# Altium schematic sheet Output_Expander.SchDoc
size A3; SheetNumber: 28; SheetTotal: 29
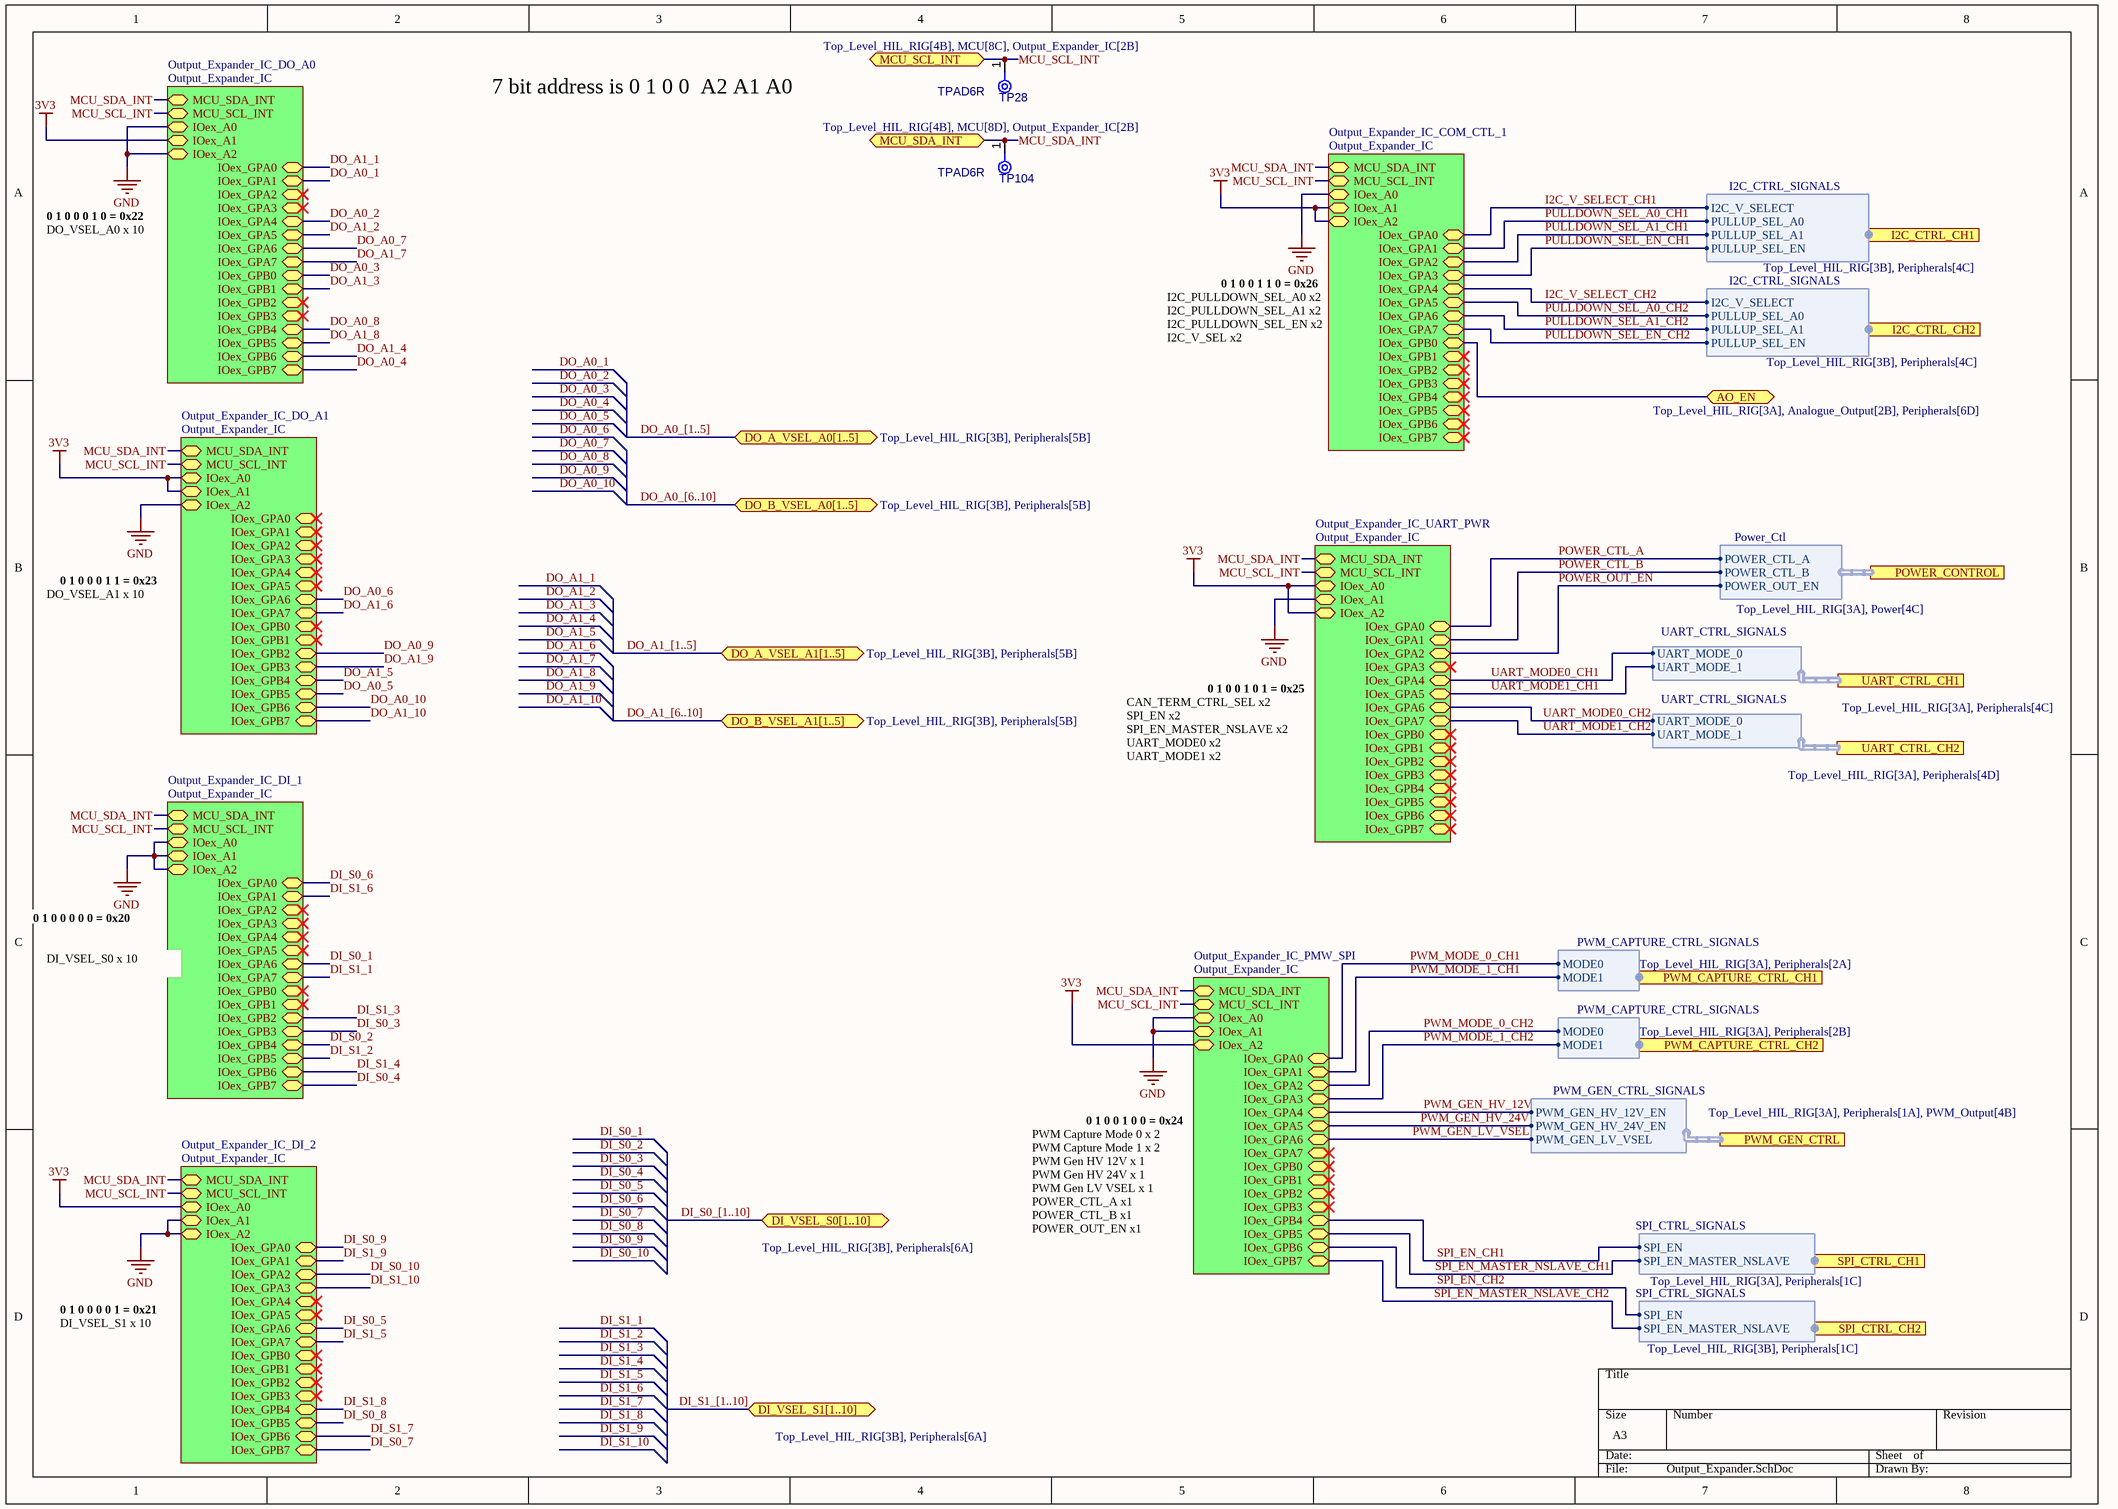
[diagram p0: Output_Expander.SchDoc]

## Parts
TP28  TPAD6R  [TP06R]  (no BOM)
TP104  TPAD6R  [TP06R]  (no BOM)

## Sub-sheets
Output_Expander_IC_COM_CTL_1 = Output_Expander_IC: MCU_SDA_INT (bidir), MCU_SCL_INT (bidir), IOex_A0 (bidir), IOex_A1 (bidir), IOex_A2 (bidir), IOex_GPA0 (bidir), IOex_GPA1 (bidir), IOex_GPA2 (bidir), IOex_GPA3 (bidir), IOex_GPA4 (bidir), IOex_GPA5 (bidir), IOex_GPA6 (bidir), IOex_GPA7 (bidir), IOex_GPB0 (bidir), IOex_GPB1 (bidir), IOex_GPB3 (bidir), IOex_GPB4 (bidir), IOex_GPB5 (bidir), IOex_GPB6 (bidir), IOex_GPB2 (bidir), IOex_GPB7 (bidir)
Output_Expander_IC_DI_1 = Output_Expander_IC: MCU_SDA_INT (bidir), MCU_SCL_INT (bidir), IOex_A0 (bidir), IOex_A1 (bidir), IOex_A2 (bidir), IOex_GPA0 (bidir), IOex_GPA1 (bidir), IOex_GPA2 (bidir), IOex_GPA3 (bidir), IOex_GPA4 (bidir), IOex_GPA5 (bidir), IOex_GPA6 (bidir), IOex_GPA7 (bidir), IOex_GPB0 (bidir), IOex_GPB1 (bidir), IOex_GPB3 (bidir), IOex_GPB4 (bidir), IOex_GPB5 (bidir), IOex_GPB6 (bidir), IOex_GPB2 (bidir), IOex_GPB7 (bidir)
Output_Expander_IC_DI_2 = Output_Expander_IC: MCU_SDA_INT (bidir), MCU_SCL_INT (bidir), IOex_A0 (bidir), IOex_A1 (bidir), IOex_A2 (bidir), IOex_GPA0 (bidir), IOex_GPA1 (bidir), IOex_GPA2 (bidir), IOex_GPA3 (bidir), IOex_GPA4 (bidir), IOex_GPA5 (bidir), IOex_GPA6 (bidir), IOex_GPA7 (bidir), IOex_GPB0 (bidir), IOex_GPB1 (bidir), IOex_GPB3 (bidir), IOex_GPB4 (bidir), IOex_GPB5 (bidir), IOex_GPB6 (bidir), IOex_GPB2 (bidir), IOex_GPB7 (bidir)
Output_Expander_IC_DO_A0 = Output_Expander_IC: MCU_SDA_INT (bidir), MCU_SCL_INT (bidir), IOex_A0 (bidir), IOex_A1 (bidir), IOex_A2 (bidir), IOex_GPA0 (bidir), IOex_GPA1 (bidir), IOex_GPA2 (bidir), IOex_GPA3 (bidir), IOex_GPA4 (bidir), IOex_GPA5 (bidir), IOex_GPA6 (bidir), IOex_GPA7 (bidir), IOex_GPB0 (bidir), IOex_GPB1 (bidir), IOex_GPB3 (bidir), IOex_GPB4 (bidir), IOex_GPB5 (bidir), IOex_GPB6 (bidir), IOex_GPB2 (bidir), IOex_GPB7 (bidir)
Output_Expander_IC_DO_A1 = Output_Expander_IC: MCU_SDA_INT (bidir), MCU_SCL_INT (bidir), IOex_A0 (bidir), IOex_A1 (bidir), IOex_A2 (bidir), IOex_GPA0 (bidir), IOex_GPA1 (bidir), IOex_GPA2 (bidir), IOex_GPA3 (bidir), IOex_GPA4 (bidir), IOex_GPA5 (bidir), IOex_GPA6 (bidir), IOex_GPB0 (bidir), IOex_GPB1 (bidir), IOex_GPB3 (bidir), IOex_GPB4 (bidir), IOex_GPB5 (bidir), IOex_GPB6 (bidir), IOex_GPB2 (bidir), IOex_GPB7 (bidir), IOex_GPA7 (bidir)
Output_Expander_IC_PMW_SPI = Output_Expander_IC: MCU_SDA_INT (bidir), MCU_SCL_INT (bidir), IOex_A0 (bidir), IOex_A1 (bidir), IOex_A2 (bidir), IOex_GPA0 (bidir), IOex_GPA1 (bidir), IOex_GPA2 (bidir), IOex_GPA3 (bidir), IOex_GPA4 (bidir), IOex_GPA5 (bidir), IOex_GPA6 (bidir), IOex_GPA7 (bidir), IOex_GPB0 (bidir), IOex_GPB1 (bidir), IOex_GPB3 (bidir), IOex_GPB4 (bidir), IOex_GPB5 (bidir), IOex_GPB6 (bidir), IOex_GPB2 (bidir), IOex_GPB7 (bidir)
Output_Expander_IC_UART_PWR = Output_Expander_IC: MCU_SDA_INT (bidir), MCU_SCL_INT (bidir), IOex_A0 (bidir), IOex_A1 (bidir), IOex_A2 (bidir), IOex_GPA0 (bidir), IOex_GPA1 (bidir), IOex_GPA2 (bidir), IOex_GPA3 (bidir), IOex_GPA4 (bidir), IOex_GPA5 (bidir), IOex_GPA6 (bidir), IOex_GPA7 (bidir), IOex_GPB0 (bidir), IOex_GPB1 (bidir), IOex_GPB3 (bidir), IOex_GPB4 (bidir), IOex_GPB5 (bidir), IOex_GPB6 (bidir), IOex_GPB2 (bidir), IOex_GPB7 (bidir)

## Ports
AO_EN (bidir, see Top_Level_HIL_RIG[3A], Analogue_Output[2B], Peripherals[6D]), DI_VSEL_S0[1..10] (bidir, see Top_Level_HIL_RIG[3B], Peripherals[6A]), DI_VSEL_S1[1..10] (bidir, see Top_Level_HIL_RIG[3B], Peripherals[6A]), DO_A_VSEL_A0[1..5] (bidir, see Top_Level_HIL_RIG[3B], Peripherals[5B]), DO_A_VSEL_A1[1..5] (bidir, see Top_Level_HIL_RIG[3B], Peripherals[5B]), DO_B_VSEL_A0[1..5] (bidir, see Top_Level_HIL_RIG[3B], Peripherals[5B]), DO_B_VSEL_A1[1..5] (bidir, see Top_Level_HIL_RIG[3B], Peripherals[5B]), I2C_CTRL_CH1 (harness I2C_CTRL_SIGNALS, see Top_Level_HIL_RIG[3B], Peripherals[4C]), I2C_CTRL_CH2 (harness I2C_CTRL_SIGNALS, see Top_Level_HIL_RIG[3B], Peripherals[4C]), MCU_SCL_INT (bidir, see Top_Level_HIL_RIG[4B], MCU[8C], Output_Expander_IC[2B]), MCU_SDA_INT (bidir, see Top_Level_HIL_RIG[4B], MCU[8D], Output_Expander_IC[2B]), POWER_CONTROL (harness Power_Ctl, see Top_Level_HIL_RIG[3A], Power[4C]), PWM_CAPTURE_CTRL_CH1 (in, harness PWM_CAPTURE_CTRL_SIGNALS, see Top_Level_HIL_RIG[3A], Peripherals[2A]), PWM_CAPTURE_CTRL_CH2 (in, harness PWM_CAPTURE_CTRL_SIGNALS, see Top_Level_HIL_RIG[3A], Peripherals[2B]), PWM_GEN_CTRL (harness PWM_GEN_CTRL_SIGNALS, see Top_Level_HIL_RIG[3A], Peripherals[1A], PWM_Output[4B]), SPI_CTRL_CH1 (harness SPI_CTRL_SIGNALS, see Top_Level_HIL_RIG[3A], Peripherals[1C]), SPI_CTRL_CH2 (harness SPI_CTRL_SIGNALS, see Top_Level_HIL_RIG[3B], Peripherals[1C]), UART_CTRL_CH1 (harness UART_CTRL_SIGNALS, see Top_Level_HIL_RIG[3A], Peripherals[4C]), UART_CTRL_CH2 (harness UART_CTRL_SIGNALS, see Top_Level_HIL_RIG[3A], Peripherals[4D])

## Harnesses
I2C_CTRL_SIGNALS: PULLUP_SEL_A0, PULLUP_SEL_EN, PULLUP_SEL_A1, I2C_V_SELECT
SPI_CTRL_SIGNALS: SPI_EN, SPI_EN_MASTER_NSLAVE
UART_CTRL_SIGNALS: UART_MODE_0, UART_MODE_1
PWM_CAPTURE_CTRL_SIGNALS: MODE1, MODE0
PWM_GEN_CTRL_SIGNALS: PWM_GEN_HV_12V_EN, PWM_GEN_HV_24V_EN, PWM_GEN_LV_VSEL
Power_Ctl: POWER_OUT_EN, POWER_CTL_B, POWER_CTL_A

## Nets
3V3: sheet Output_Expander_IC_DI_2/IOex_A0, sheet Output_Expander_IC_DO_A0/IOex_A1, sheet Output_Expander_IC_DO_A1/IOex_A0, sheet Output_Expander_IC_DO_A1/IOex_A1, sheet Output_Expander_IC_COM_CTL_1/IOex_A1, sheet Output_Expander_IC_COM_CTL_1/IOex_A2, sheet Output_Expander_IC_UART_PWR/IOex_A0, sheet Output_Expander_IC_UART_PWR/IOex_A2, sheet Output_Expander_IC_PMW_SPI/IOex_A2
GND: sheet Output_Expander_IC_DI_1/IOex_A0, sheet Output_Expander_IC_DI_1/IOex_A1, sheet Output_Expander_IC_DI_1/IOex_A2, sheet Output_Expander_IC_DI_2/IOex_A1, sheet Output_Expander_IC_DI_2/IOex_A2, sheet Output_Expander_IC_DO_A0/IOex_A0, sheet Output_Expander_IC_DO_A0/IOex_A2, sheet Output_Expander_IC_DO_A1/IOex_A2, sheet Output_Expander_IC_COM_CTL_1/IOex_A0, sheet Output_Expander_IC_UART_PWR/IOex_A1, sheet Output_Expander_IC_PMW_SPI/IOex_A0, sheet Output_Expander_IC_PMW_SPI/IOex_A1
AO_EN: port AO_EN, sheet Output_Expander_IC_COM_CTL_1/IOex_GPB0
DI_S0_1: sheet Output_Expander_IC_DI_1/IOex_GPA6
DI_S0_2: sheet Output_Expander_IC_DI_1/IOex_GPB4
DI_S0_3: sheet Output_Expander_IC_DI_1/IOex_GPB3
DI_S0_4: sheet Output_Expander_IC_DI_1/IOex_GPB7
DI_S0_5: sheet Output_Expander_IC_DI_2/IOex_GPA6
DI_S0_6: sheet Output_Expander_IC_DI_1/IOex_GPA0
DI_S0_7: sheet Output_Expander_IC_DI_2/IOex_GPB7
DI_S0_8: sheet Output_Expander_IC_DI_2/IOex_GPB5
DI_S0_9: sheet Output_Expander_IC_DI_2/IOex_GPA0
DI_S0_10: sheet Output_Expander_IC_DI_2/IOex_GPA2
DI_S1_1: sheet Output_Expander_IC_DI_1/IOex_GPA7
DI_S1_2: sheet Output_Expander_IC_DI_1/IOex_GPB5
DI_S1_3: sheet Output_Expander_IC_DI_1/IOex_GPB2
DI_S1_4: sheet Output_Expander_IC_DI_1/IOex_GPB6
DI_S1_5: sheet Output_Expander_IC_DI_2/IOex_GPA7
DI_S1_6: sheet Output_Expander_IC_DI_1/IOex_GPA1
DI_S1_7: sheet Output_Expander_IC_DI_2/IOex_GPB6
DI_S1_8: sheet Output_Expander_IC_DI_2/IOex_GPB4
DI_S1_9: sheet Output_Expander_IC_DI_2/IOex_GPA1
DI_S1_10: sheet Output_Expander_IC_DI_2/IOex_GPA3
DO_A0_1: sheet Output_Expander_IC_DO_A0/IOex_GPA1
DO_A0_2: sheet Output_Expander_IC_DO_A0/IOex_GPA4
DO_A0_3: sheet Output_Expander_IC_DO_A0/IOex_GPB0
DO_A0_4: sheet Output_Expander_IC_DO_A0/IOex_GPB7
DO_A0_5: sheet Output_Expander_IC_DO_A1/IOex_GPB5
DO_A0_6: sheet Output_Expander_IC_DO_A1/IOex_GPA6
DO_A0_7: sheet Output_Expander_IC_DO_A0/IOex_GPA6
DO_A0_8: sheet Output_Expander_IC_DO_A0/IOex_GPB4
DO_A0_9: sheet Output_Expander_IC_DO_A1/IOex_GPB2
DO_A0_10: sheet Output_Expander_IC_DO_A1/IOex_GPB6
DO_A1_1: sheet Output_Expander_IC_DO_A0/IOex_GPA0
DO_A1_2: sheet Output_Expander_IC_DO_A0/IOex_GPA5
DO_A1_3: sheet Output_Expander_IC_DO_A0/IOex_GPB1
DO_A1_4: sheet Output_Expander_IC_DO_A0/IOex_GPB6
DO_A1_5: sheet Output_Expander_IC_DO_A1/IOex_GPB4
DO_A1_6: sheet Output_Expander_IC_DO_A1/IOex_GPA7
DO_A1_7: sheet Output_Expander_IC_DO_A0/IOex_GPA7
DO_A1_8: sheet Output_Expander_IC_DO_A0/IOex_GPB5
DO_A1_9: sheet Output_Expander_IC_DO_A1/IOex_GPB3
DO_A1_10: sheet Output_Expander_IC_DO_A1/IOex_GPB7
I2C_V_SELECT_CH1: sheet Output_Expander_IC_COM_CTL_1/IOex_GPA0, port I2C_CTRL_CH1.I2C_V_SELECT
I2C_V_SELECT_CH2: sheet Output_Expander_IC_COM_CTL_1/IOex_GPA4, port I2C_CTRL_CH2.I2C_V_SELECT
MCU_SCL_INT: TP28.1(TP) ; port MCU_SCL_INT, sheet Output_Expander_IC_DI_1/MCU_SCL_INT, sheet Output_Expander_IC_DI_2/MCU_SCL_INT, sheet Output_Expander_IC_DO_A0/MCU_SCL_INT, sheet Output_Expander_IC_DO_A1/MCU_SCL_INT, sheet Output_Expander_IC_COM_CTL_1/MCU_SCL_INT, sheet Output_Expander_IC_UART_PWR/MCU_SCL_INT, sheet Output_Expander_IC_PMW_SPI/MCU_SCL_INT
MCU_SDA_INT: TP104.1(TP) ; port MCU_SDA_INT, sheet Output_Expander_IC_DI_1/MCU_SDA_INT, sheet Output_Expander_IC_DI_2/MCU_SDA_INT, sheet Output_Expander_IC_DO_A0/MCU_SDA_INT, sheet Output_Expander_IC_DO_A1/MCU_SDA_INT, sheet Output_Expander_IC_COM_CTL_1/MCU_SDA_INT, sheet Output_Expander_IC_UART_PWR/MCU_SDA_INT, sheet Output_Expander_IC_PMW_SPI/MCU_SDA_INT
POWER_CTL_A: sheet Output_Expander_IC_UART_PWR/IOex_GPA0, port POWER_CONTROL.POWER_CTL_A
POWER_CTL_B: sheet Output_Expander_IC_UART_PWR/IOex_GPA1, port POWER_CONTROL.POWER_CTL_B
POWER_OUT_EN: sheet Output_Expander_IC_UART_PWR/IOex_GPA2, port POWER_CONTROL.POWER_OUT_EN
PULLDOWN_SEL_A0_CH1: sheet Output_Expander_IC_COM_CTL_1/IOex_GPA1, port I2C_CTRL_CH1.PULLUP_SEL_A0
PULLDOWN_SEL_A0_CH2: sheet Output_Expander_IC_COM_CTL_1/IOex_GPA5, port I2C_CTRL_CH2.PULLUP_SEL_A0
PULLDOWN_SEL_A1_CH1: sheet Output_Expander_IC_COM_CTL_1/IOex_GPA2, port I2C_CTRL_CH1.PULLUP_SEL_A1
PULLDOWN_SEL_A1_CH2: sheet Output_Expander_IC_COM_CTL_1/IOex_GPA6, port I2C_CTRL_CH2.PULLUP_SEL_A1
PULLDOWN_SEL_EN_CH1: sheet Output_Expander_IC_COM_CTL_1/IOex_GPA3, port I2C_CTRL_CH1.PULLUP_SEL_EN
PULLDOWN_SEL_EN_CH2: sheet Output_Expander_IC_COM_CTL_1/IOex_GPA7, port I2C_CTRL_CH2.PULLUP_SEL_EN
PWM_GEN_HV_12V: sheet Output_Expander_IC_PMW_SPI/IOex_GPA4, port PWM_GEN_CTRL.PWM_GEN_HV_12V_EN
PWM_GEN_HV_24V: sheet Output_Expander_IC_PMW_SPI/IOex_GPA5, port PWM_GEN_CTRL.PWM_GEN_HV_24V_EN
PWM_GEN_LV_VSEL: sheet Output_Expander_IC_PMW_SPI/IOex_GPA6, port PWM_GEN_CTRL.PWM_GEN_LV_VSEL
PWM_MODE_0_CH1: sheet Output_Expander_IC_PMW_SPI/IOex_GPA0, port PWM_CAPTURE_CTRL_CH1.MODE0
PWM_MODE_0_CH2: sheet Output_Expander_IC_PMW_SPI/IOex_GPA2, port PWM_CAPTURE_CTRL_CH2.MODE0
PWM_MODE_1_CH1: sheet Output_Expander_IC_PMW_SPI/IOex_GPA1, port PWM_CAPTURE_CTRL_CH1.MODE1
PWM_MODE_1_CH2: sheet Output_Expander_IC_PMW_SPI/IOex_GPA3, port PWM_CAPTURE_CTRL_CH2.MODE1
SPI_EN_CH1: sheet Output_Expander_IC_PMW_SPI/IOex_GPB4, port SPI_CTRL_CH1.SPI_EN
SPI_EN_CH2: sheet Output_Expander_IC_PMW_SPI/IOex_GPB6, port SPI_CTRL_CH2.SPI_EN
SPI_EN_MASTER_NSLAVE_CH1: sheet Output_Expander_IC_PMW_SPI/IOex_GPB5, port SPI_CTRL_CH1.SPI_EN_MASTER_NSLAVE
SPI_EN_MASTER_NSLAVE_CH2: sheet Output_Expander_IC_PMW_SPI/IOex_GPB7, port SPI_CTRL_CH2.SPI_EN_MASTER_NSLAVE
UART_MODE0_CH1: sheet Output_Expander_IC_UART_PWR/IOex_GPA4, port UART_CTRL_CH1.UART_MODE_0
UART_MODE0_CH2: sheet Output_Expander_IC_UART_PWR/IOex_GPA6, port UART_CTRL_CH2.UART_MODE_0
UART_MODE1_CH1: sheet Output_Expander_IC_UART_PWR/IOex_GPA5, port UART_CTRL_CH1.UART_MODE_1
UART_MODE1_CH2: sheet Output_Expander_IC_UART_PWR/IOex_GPA7, port UART_CTRL_CH2.UART_MODE_1

## Buses and harness runs
bus DI_S0_[1..10] = port DI_VSEL_S0[1..10]
bus DI_S1_[1..10] = port DI_VSEL_S1[1..10]
bus DO_A0_[1..5] = port DO_A_VSEL_A0[1..5]
bus DO_A0_[6..10] = port DO_B_VSEL_A0[1..5]
bus DO_A1_[1..5] = port DO_A_VSEL_A1[1..5]
bus DO_A1_[6..10] = port DO_B_VSEL_A1[1..5]

## Notes on the sheet
- 7 bit address is 0 1 0 0  A2 A1 A0
- 0 1 0 0 0 1 0 = 0x22
- DO_VSEL_A0 x 10
- 0 1 0 0 1 1 0 = 0x26
- I2C_PULLDOWN_SEL_A0 x2
  I2C_PULLDOWN_SEL_A1 x2
  I2C_PULLDOWN_SEL_EN x2
  I2C_V_SEL x2
- 0 1 0 0 0 1 1 = 0x23
- DO_VSEL_A1 x 10
- 0 1 0 0 1 0 1 = 0x25
- CAN_TERM_CTRL_SEL x2
  SPI_EN x2
  SPI_EN_MASTER_NSLAVE x2
  UART_MODE0 x2
  UART_MODE1 x2
- 0 1 0 0 0 0 0 = 0x20
- DI_VSEL_S0 x 10
- 0 1 0 0 1 0 0 = 0x24
- PWM Capture Mode 0 x 2
  PWM Capture Mode 1 x 2
  PWM Gen HV 12V x 1
  PWM Gen HV 24V x 1
  PWM Gen LV VSEL x 1
  POWER_CTL_A x1
  POWER_CTL_B x1
  POWER_OUT_EN x1
- 0 1 0 0 0 0 1 = 0x21
- DI_VSEL_S1 x 10

## Library data of the parts
TP28 TP104 = CMP-00028-00002-2: 0.6mm round; Pins: 1